# EAGLE design Bidirectional_Logic_Conv (EAGLE 7.2.0)
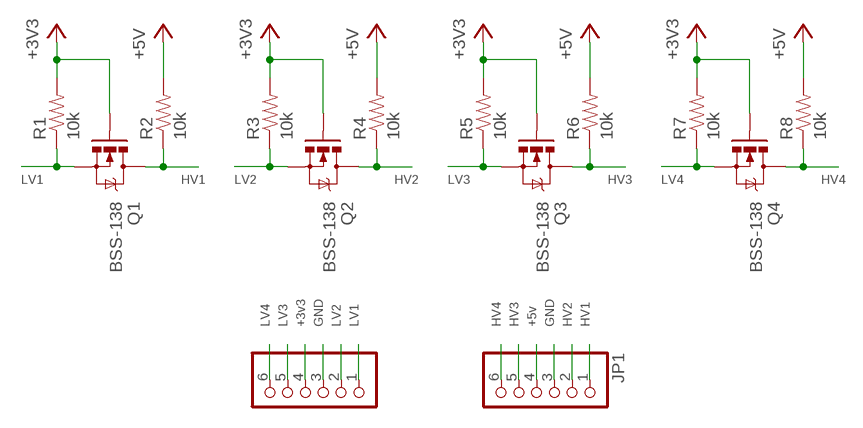
[diagram p0: schematic, sheet 1]

## Parts
JP1  PINHD-1X6  [1X06]
Q1  BSS-138  MOSFET-NCHANNELSMD  [SOT23-3]
Q2  BSS-138  MOSFET-NCHANNELSMD  [SOT23-3]
Q3  BSS-138  MOSFET-NCHANNELSMD  [SOT23-3]
Q4  BSS-138  MOSFET-NCHANNELSMD  [SOT23-3]
R1  10k  RESISTOR1206  [1206]
R2  10k  RESISTOR1206  [1206]
R3  10k  RESISTOR1206  [1206]
R4  10k  RESISTOR1206  [1206]
R5  10k  RESISTOR1206  [1206]
R6  10k  RESISTOR1206  [1206]
R7  10k  RESISTOR1206  [1206]
R8  10k  RESISTOR1206  [1206]
   PINHD-1X6  [1X06]

## Nets
+3V3: Q1.1(G) Q2.1(G) Q3.1(G) Q4.1(G) R1.2 R3.2 R5.2 R7.2  .4
+5V: JP1.4 R2.2 R4.2 R6.2 R8.2
GND: JP1.3  .3
HV1: JP1.1 Q1.3(D) R2.1
HV2: JP1.2 Q2.3(D) R4.1
HV3: JP1.5 Q3.3(D) R6.1
HV4: JP1.6 Q4.3(D) R8.1
LV1: Q1.2(S) R1.1  .1
LV2: Q2.2(S) R3.1  .2
LV3: Q3.2(S) R5.1  .5
LV4: Q4.2(S) R7.1  .6

## Notes on the sheet
- LV1 | HV1 | LV2 | HV2 | LV3 | HV3 | LV4 | HV4
- LV4 | LV3 | +3v3 | GND | LV2 | LV1 | HV4 | HV3 | +5v | GND | HV2 | HV1

## Library data of the parts
JP1   = pinhead:PINHD-1X6: PIN HEADER
Q1-Q4 = SparkFun:MOSFET-NCHANNEL
R1-R8 = SparkFun:RESISTOR: Resistor Basic schematic elements and footprints for 0603, 1206, and PTH 1/10th watt (small) resistors.

## Board
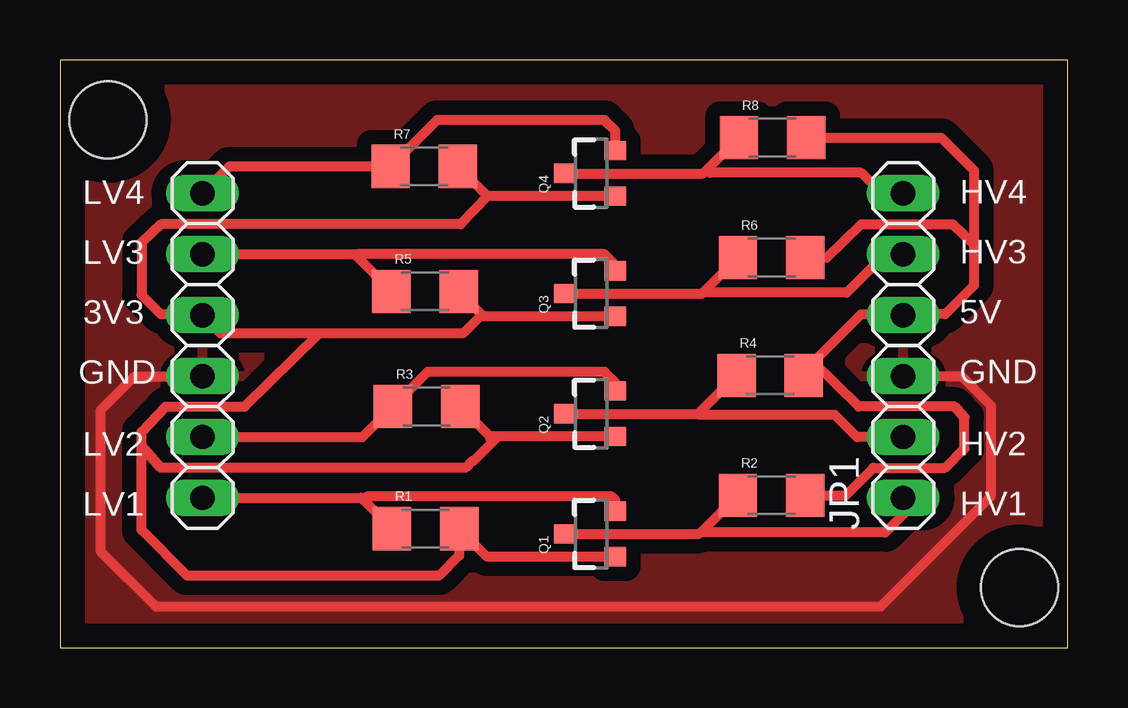
[diagram p1: board, top side]

Size 42 x 24.5 mm. Coordinates in mm from the lower left corner, seen from the top.
Outline: 0,0 42,0 42,24.5 0,24.5 0,0
Copper layers (1*16): Top 0.035mm / dielectric 1.5mm / Bottom 0.035mm
Design rules "default": minimum track width 10mil, minimum drill 24mil, track to track 8mil, track to pad 8mil, pad to pad 8mil, via to via 8mil, smd to smd 8mil, copper to edge 40mil, drill to drill 8mil, minimum pad ring 10mil, minimum via ring 8mil, stop-mask expansion 4mil, vias tented up to drill 0mil, thermal gap 10mil
Holes 3.2 mm at 2,22 40,2.5

### Footprints (pad centres in the part's own frame; a part is rotated, then mirrored left to right if it is on the bottom)
1X06 = drill 1.016 long: 1 -6.35,0; 2 -3.81,0; 3 -1.27,0; 4 1.27,0; 5 3.81,0; 6 6.35,0
SOT23-3 = smd 0.8 x 0.9: 1 -0.95,-1; 2 0.95,-1; 3 0,1.1
1206 = smd 1.6 x 1.8: 1 -1.4,0; 2 1.4,0

### Placement (x,y rotation side)
JP1  35.15,12.59 90 top
Q1  22.15,4.74 90 top
Q2  22.15,9.75 90 top
Q3  22.15,14.76 90 top
Q4  22.15,19.77 90 top
R1  15.24,4.96 0 top
R2  29.66,6.35 0 top
R3  15.28,10.05 0 top
R4  29.6,11.35 0 top
R5  15.22,14.85 0 top
R6  29.66,16.26 0 top
R7  15.18,20.06 0 top
R8  29.7,21.26 0 top
   5.94,12.59 90 top

### Tracks (layer width: path | path; a pad name or v marks a point on that pad's centre or on a via)
+3V3
  Top 0.406: Q1.1 17.81,3.79 R1.2 16.64,3.84 15.8,3 5.3,3 3.4,4.9 3.4,8.4 | Q2.1 18.25,8.8 | 18.25,8.8 17.93,8.8 | 17.93,8.8 R3.2 | Q4.1 17.82,18.82 | 17.82,18.82 R7.2 | Q3.1 17.66,13.81 | 17.66,13.81 R5.2 | 17.82,18.82 16.7,17.65 4.2,17.65 3.4,16.9 3.4,14.7 4.2,13.9 5.9,13.9  .4 6.7,13.1 10.8,13.1 | 17.66,13.81 17.51,13.81 16.8,13.1 10.8,13.1 | 17.93,8.8 17.93,8.73 | 3.4,8.4 4.2,7.5 16.9,7.5 17.2,7.8 17.25,7.8 18.25,8.8 | 3.4,8.4 3.4,9 4.4,10.05 7.7,10.05 10.8,13.1
+5V
  Top 0.406: R8.2 36.74,21.26 38.1,19.9 38.1,16.8 | 38.1,16.8 38.1,15.1 36.9,13.9 35.19,13.9 JP1.4 35.11,13.9 33.4,13.9 31.4,11.9 | R6.2 31.96,16.26 33.4,17.65 37.2,17.65 38.1,16.8 | R4.2 31,11.5 31.4,11.9 | R2.2 32.75,6.35 33.9,7.5 36.9,7.5 37.7,8.3 37.7,9.6 37.3,10.05 33.3,10.05 31.4,11.9
GND
  Top 0.406: JP1.3 37.58,11.32 38.8,10.1 38.8,6.3 34.2,1.7 4,1.7 1.7,4 1.7,9.9 3.1,11.3 5.92,11.3  .3
  pour Top (isolate 0.61): 0,0 0,24.5 42,24.5 42,0
HV1
  Top 0.406: Q1.3 26.65,4.74 26.71,4.8 | 26.71,4.8 R2.1 | JP1.1 35.15,5.55 34.4,4.8 26.71,4.8
HV2
  Top 0.406: Q2.3 26.6,9.75 | 26.6,9.75 R4.1 | JP1.2 33.22,8.78 32.3,9.7 26.65,9.7 26.6,9.75
HV3
  Top 0.406: Q3.3 26.76,14.76 26.8,14.8 | 26.8,14.8 R6.1 | JP1.5 34.4,16.4 32.8,14.8 26.8,14.8
HV4
  Top 0.406: Q4.3 26.81,19.77 26.97,19.93 | 26.97,19.93 R8.1 | JP1.6 34.26,18.94 33.4,19.8 27.1,19.8 26.97,19.93
LV1
  Top 0.406:  .1 12.56,6.24 12.65,6.15 | 12.65,6.15 R1.1 | Q1.2 23.15,6.15 23,6.3 12.8,6.3 12.65,6.15
LV2
  Top 0.406:  .2 12.61,8.78 R3.1 15.33,11.5 22.7,11.5 23.15,11.05 Q2.2
LV3
  Top 0.406:  .5 12.27,16.4 12.34,16.34 | 12.34,16.34 R5.1 | Q3.2 23.15,15.95 22.7,16.4 12.4,16.4 12.34,16.34
LV4
  Top 0.406:  .6 7.06,20.06 R7.1 15.72,22 22.7,22 23.15,21.55 Q4.2

### Text on the board
tNames: LV4 | HV4 | LV3 | HV3 | 3V3 | 5V | GND | GND | LV2 | HV2 | LV1 | HV1